# Altium schematic sheet Maket.SchDoc
size B
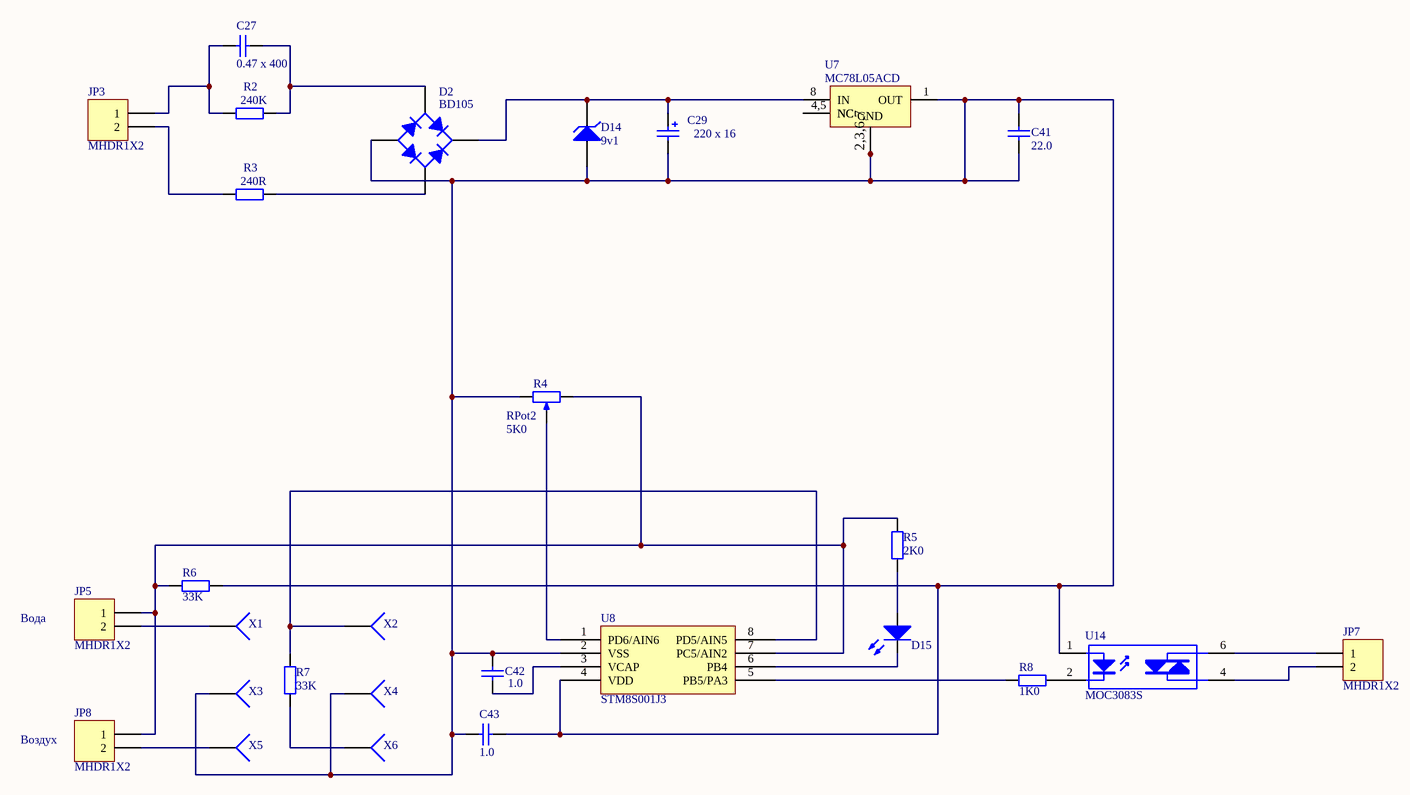
[diagram p0: Maket.SchDoc]

## Parts
C27  0.47 x 400  [_1206]
C29  220 x 16  [el3]
C41  22.0  [_1206]
C42  1.0  [_1206]
C43  1.0  [_1206]
D2  BD105  [DF01]
D14  9v1  [DIODE-0.7]
D15  LED0  [el3]  (value not drawn)
JP3  MHDR1X2  [MHDR1X2]
JP5  MHDR1X2  [MHDR1X2]
JP7  MHDR1X2  [MHDR1X2]
JP8  MHDR1X2  [MHDR1X2]
R2  240K  [_1206]
R3  240R  [_1206]
R4  RPot2  value 5K0  [VR2]
R5  2K0  [_1206]
R6  33K  [_1206]
R7  33K  [_1206]
R8  1K0  [_1206]
U7  MC78L05ACD  [SO-G8]
U8  STM8S001J3
U14  MOC3083S  [smdip6]
X1  (no value)  [PIN1]
X2  (no value)  [PIN1]
X3  (no value)  [PIN1]
X4  (no value)  [PIN1]
X5  (no value)  [PIN1]
X6  (no value)  [PIN1]

## Nets
NetC27_1: C27.1 D2.2(C) R2.1
NetC27_2: C27.2 JP3.1 R2.2
NetC29_1: C29.1 D2.3(K) D14.2(K) U7.8(IN)
NetC29_2: C29.2 C41.1 C41.2 C42.2 C43.1 C43.2 D2.1(A) D14.1(A) R4.1(TOP) R6.2 U7.1(OUT) U7.2(GND) U7.3(GND) U7.6(GND) U7.7(GND) U8.2(VSS) U8.4(VDD) U14.1(A) X3.1 X4.1
NetC42_1: C42.1 U8.3(VCAP)
NetD2_4: D2.4(C) R3.1
NetD15_1: D15.1(A) R5.1
NetD15_2: D15.2(K) U8.6(PB4)
NetJP3_2: JP3.2 R3.2
NetJP5_1: JP5.1 JP8.1 R4.2(BOT) R5.2 R6.1 U8.7(PC5/AIN2)
NetJP5_2: JP5.2 X1.1
NetJP7_1: JP7.1 U14.6(A/K)
NetJP7_2: JP7.2 U14.4(A/K)
NetJP8_2: JP8.2 X5.1
NetR4_3: R4.3(TAP) U8.1(PD6/AIN6)
NetR7_1: R7.1 U8.8(PD5/AIN5) X2.1
NetR7_2: R7.2 X6.1
NetR8_1: R8.1 U14.2(K)
NetR8_2: R8.2 U8.5(PB5/PA3)
NetU7_4: U7.4(NC) U7.5(NC)

## Notes on the sheet
- Вода
- Воздух
- (in symbol MC78L05ACD) 4,5; 2,3,6,7

## Library data of the parts
C27 C42 C43 = Cap Semi: Capacitor; Manufacturer: Generic Components; Class I: Passive; Value: 0,1; Published: 8-Jun-2000; Revision: July-2002: Re-released for DXP Platform.; Publisher: Altium Limited; Class II: Capacitor
C29 = Cap Pol1: Polarized Capacitor (Radial); Manufacturer: Generic Components; Class I: Passive; Value: 22,0x50; Published: 8-Jun-2000; Revision: July-2002: Re-released for DXP Platform.; Publisher: Altium Limited; Class II: Capacitor
C41 = Cap Semi: Capacitor (Semiconductor SIM Model); Manufacturer: Generic Components; Class I: Passive; Value: 1,0; Published: 8-Jun-2000; Revision: July-2002: Re-released for DXP Platform.; Publisher: Altium Limited; Class II: Capacitor
D2 = Bridge1: Full Wave Diode Bridge; Manufacturer: Generic Components; Class I: Discrete; Class II: Rectifier - Bridge; Published: 8-Jun-2000; Revision: July-2002: Re-released for DXP Platform.; Publisher: Altium Limited
D14 = D Zener: Zener Diode; Manufacturer: Generic Components; Class I: Discrete; Class II: Diode - Zener; Published: 8-Jun-2000; Revision: July-2002: Re-released for DXP Platform.; Publisher: Altium Limited
D15 = LED0: Typical INFRARED GaAs LED; Manufacturer: Generic Components; Class I: Optoelectronic; Published: 8-Jun-2000; Revision: July-2002: Re-released for DXP Platform.; Publisher: Altium Limited; Class II: LED
JP3 JP5 JP7 JP8 = MHDR1X2: Header, 2-Pin; Manufacturer: Generic Components; Class I: Connector; Revision: July-2002: Re-released for DXP Platform.; Publisher: Altium Limited
R2 R3 R5 = Res2: Resistor; Manufacturer: Generic Components; Class I: Passive; Value: 2K7; Rule: Undefined; Published: 8-Jun-2000; Revision: July-2002: Re-released for DXP Platform.; Publisher: Altium Limited; Class II: Resistor
R4 = RPot2: Potentiometer; Manufacturer: Generic Components; Class I: Passive; Set Position: 0.5; Published: 8-Jun-2000; Revision: July-2002: Re-released for DXP Platform.; Publisher: Altium Limited; Class II: Potentiometer
R6 R7 = Res2: Resistor; Manufacturer: Generic Components; Class I: Passive; Value: 1K0; Published: 8-Jun-2000; Revision: July-2002: Re-released for DXP Platform.; Publisher: Altium Limited; Class II: Resistor
R8 = Res2: Resistor; Manufacturer: Generic Components; Class I: Passive; Published: 8-Jun-2000; Revision: July-2002: Re-released for DXP Platform.; Publisher: Altium Limited; Class II: Resistor; Value: 1K0
U7 = MC78L05ACD: 3-Terminal Low-Current Positive Fixed Voltage Regulator; Manufacturer: Motorola; Class I: Power Management; Published: 15-Apr-2002; Datasheet: Linear and Interface Integrated Circuits, DL128 Rev2 (1988); Package Reference: 751-02; Publisher: Altium Limited; Class II: Voltage Regulator
U14 = Opto TRIAC: Opto-Triac; Manufacturer: Generic Components; Class I: Optoelectronic; Published: 24-Mar-1999; Revision: July-2002: Re-released for DXP Platform.; Publisher: Altium Limited
X1-X6 = Socket: Manufacturer: Generic Components; Class I: Connector; Revision: July-2002: Re-released for DXP Platform.; Publisher: Altium Limited